# EAGLE design Anemometro8285 (EAGLE 7.5.0)
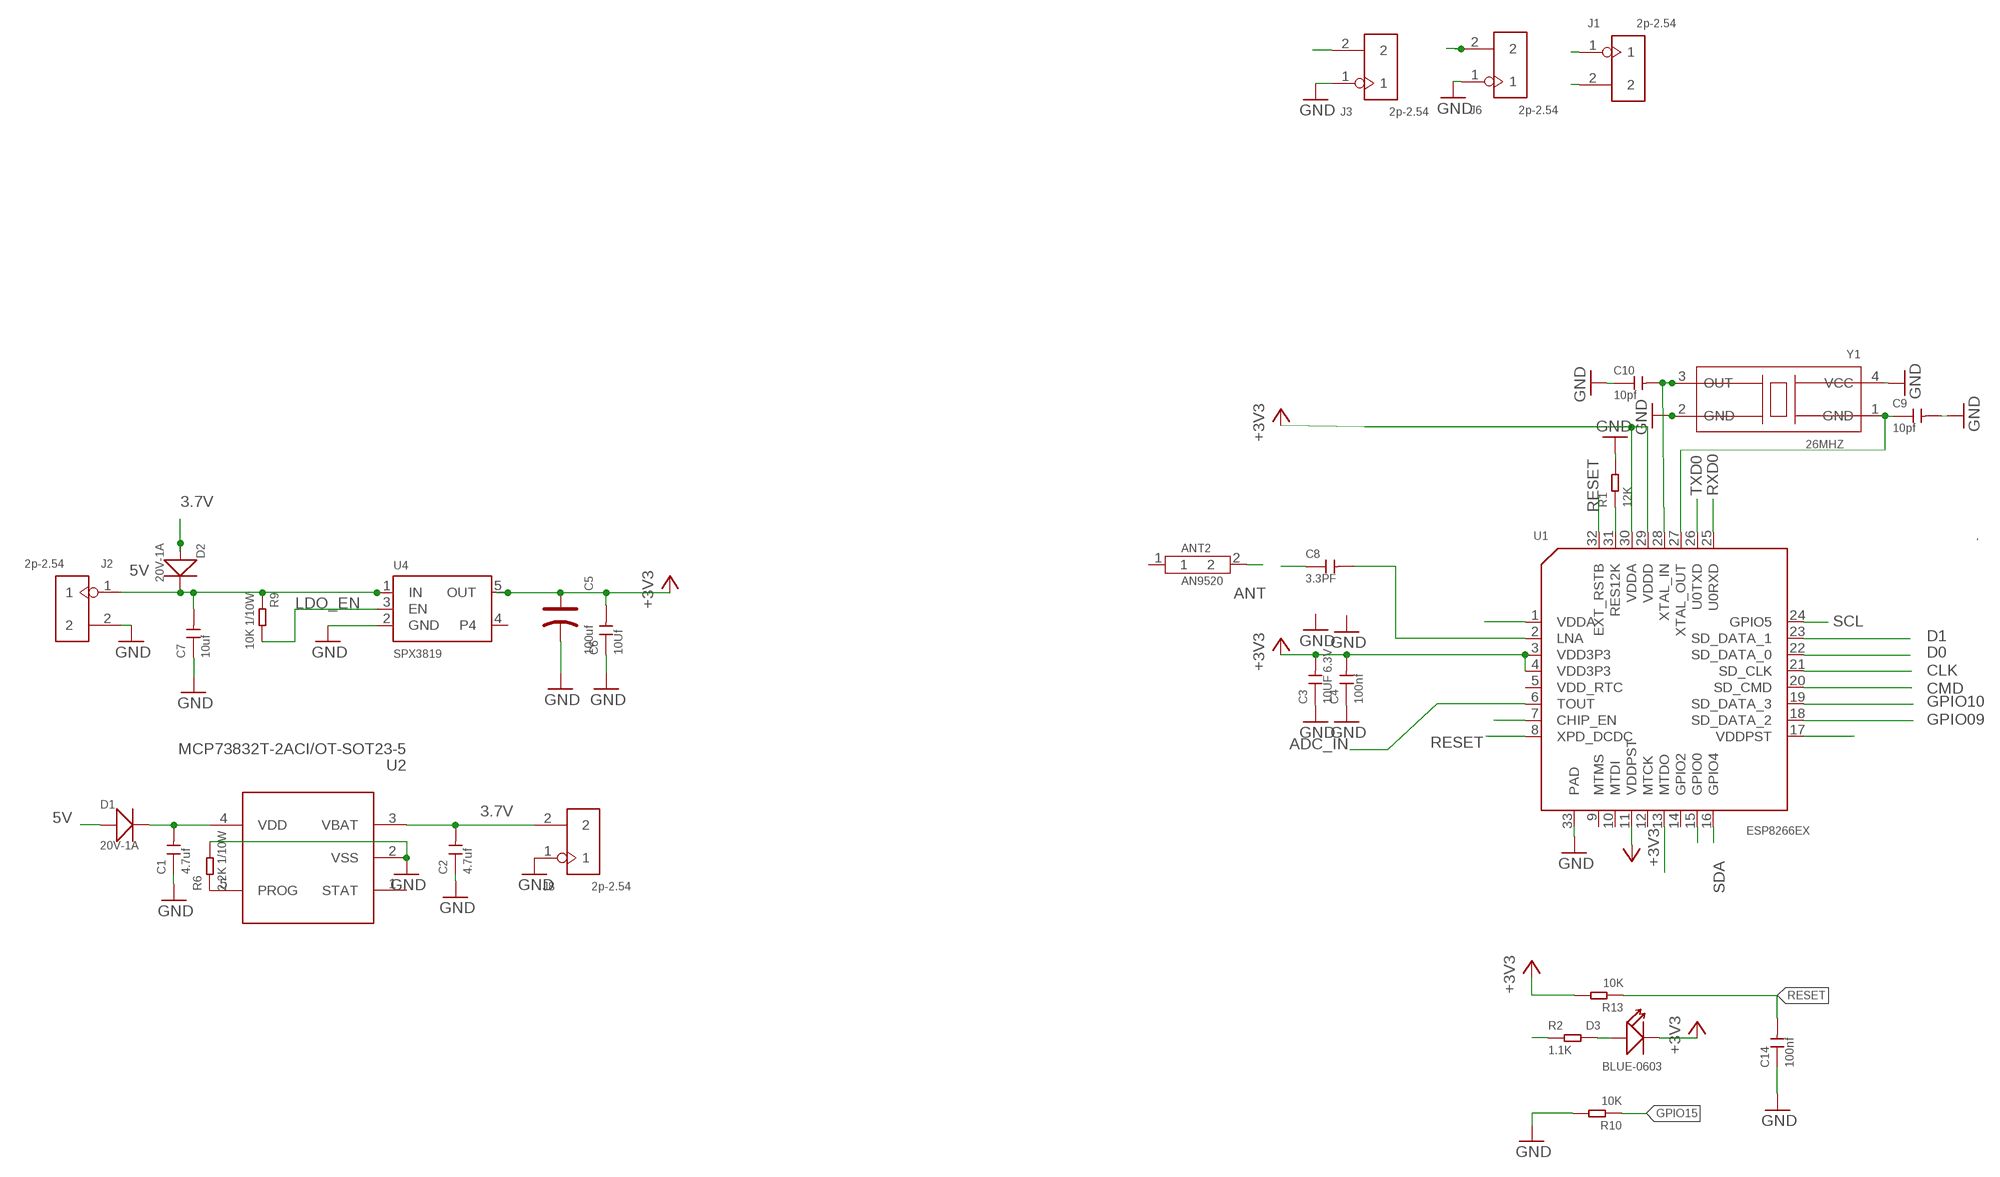
[diagram p0: schematic, sheet 1]

## Parts
ANT2  AN9520  SMD-BUILT-IN-ANTENNA-2.4GHZ(2P-9.5X2.1MM)  [ANT2-SMD-9.5X2X1.2MM]
C1  4.7uf  CERAMIC-4.7UF-10V-10%-X5R(0603)  [C0603]
C2  4.7uf  CERAMIC-4.7UF-10V-10%-X5R(0603)  [C0603]
C3  10UF 6.3V  CERAMIC-10UF-6.3V-20%-X5R(0603)  [C0603]
C4  100nf  CERAMIC-100NF-50V-10%-X7R(0603)  [C0603]
C5  100uf  TANTALUM-SMD-100UF-10V(AVX-B)  [AVX-B]
C6  10Uf  CERAMIC-100NF-50V-10%-X7R(0603)  [C0603]
C7  10uf  CERAMIC-10UF-25V-10%-X5R(0805)  [C0805]
C8  3.3PF  CERAMIC-3.3PF-50V-0.25PF-NPO(0603)  [C0603]
C9  10pf  CERAMIC-10PF-50V-5%-NPO(0603)  [C0603]
C10  10pf  CERAMIC-10PF-50V-5%-NPO(0603)  [C0603]
C14  100nf  CERAMIC-100NF-50V-10%-X7R(0603)  [C0603]
D1  20V-1A  SMD-DIODE-SCHOTTKY-20V-1A(SOD-123)  [SOD-123]
D2  20V-1A  SMD-DIODE-SCHOTTKY-20V-1A(SOD-123)  [SOD-123]
D3  BLUE-0603  SMD-LED-CLEAR-BLUE(0603)  [LED-0603]
J1  2p-2.54  DIP-BLACK-FEMALE-HEADER-VERT(2P-2.54)  [H2-2.54]
J2  2p-2.54  DIP-BLACK-FEMALE-HEADER-VERT(2P-2.54)  [H2-2.54]
J3  2p-2.54  DIP-BLACK-MALE-HEADER-VERT(2P-2.54)  [H2-2.54]
J6  2p-2.54  DIP-BLACK-MALE-HEADER-VERT(2P-2.54)  [H2-2.54]
J8  2p-2.54  DIP-BLACK-FEMALE-HEADER-VERT(2P-2.54)  [H2-2.54]
R1  12K  SMD-RES-12K-1%-1/10W(0603)  [R0603]
R2  1.1K  SMD-RES-1.1K-5%-1/10W(0603)  [R0603]
R6  2.2K 1/10W  SMD-RES-2.2K-1%-1/10W(0603)  [R0603]
R9  10K 1/10W  SMD-RES-10K-5%-1/10W(0603)  [R0603]
R10  10K  SMD-RES-0R-5%-1/10W(0603)  [R0603]
R13  10K  SMD-RES-0R-5%-1/10W(0603)  [R0603]
U1  ESP8266EX  IC-RF-ESP8266EX(QFN32)  [QFN32G-0.5-5X5MM]
U2  MCP73832T-2ACI/OT-SOT23-5  PMIC-MCP73832T-2ACI/OT(SOT23-5)  [SOT-23-5]
U4  SPX3819  VREG_SOT23-5  [SOT23-5]
Y1  26MHZ  SMD-CRYSTAL-26MHZ(4P-2.5X2.0X0.8MM)  [X4-SMD-2.5X2.0X0.5MM]

## Nets
3.7V: C2.2 D2.+ J8.2 U2.3(VBAT)
5V: C7.2 D1.+ D2.- J2.1 R9.1 U4.1(IN)
+3V3: C3.2 C4.2 C5.+ C6.2 D3.- R13.2 U1.1(VDDA) U1.3(VDD3P3) U1.4(VDD3P3) U1.7(CHIP_EN) U1.11(VDDPST) U1.17(VDDPST) U1.29(VDDD) U1.30(VDDA) U4.5(OUT)
ADC_IN: U1.6(TOUT)
ANT: ANT2.2 C8.1
CLK: U1.21(SD_CLK)
CMD: U1.20(SD_CMD)
D0: U1.22(SD_DATA_0)
D1: U1.23(SD_DATA_1)
GND: C1.1 C2.1 C3.1 C4.1 C5.- C6.1 C7.1 C9.2 C10.1 C14.1 J2.2 J3.1 J6.1 J8.1 R1.2 R6.2 R10.2 U1.33(PAD) U2.2(VSS) U4.2(GND) Y1.2(GND) Y1.4(VCC)
GPIO0: J3.2 U1.15(GPIO0)
GPIO09: U1.18(SD_DATA_2)
GPIO10: U1.19(SD_DATA_3)
GPIO15: R10.1 U1.13(MTDO)
LDO_EN: R9.2 U4.3(EN)
N$1: C8.2 U1.2(LNA)
N$2: R6.1 U2.5(PROG)
N$3: C9.1 U1.27(XTAL_OUT) Y1.1(GND)
N$5: R1.1 U1.31(RES12K)
N$6: C10.2 U1.28(XTAL_IN) Y1.3(OUT)
N$7: D3.+ R2.2
N$8: C1.2 D1.- U2.4(VDD)
RESET: C14.2 R13.1 U1.8(XPD_DCDC) U1.32(EXT_RSTB)
RXD0: J1.2 U1.25(U0RXD)
SCL: J6.2 U1.24(GPIO5)
SDA: U1.16(GPIO4)
TXD0: J1.1 R2.1 U1.26(U0TXD)
Unconnected: ANT2.1 U1.5(VDD_RTC) U1.9(MTMS) U1.10(MTDI) U1.12(MTCK) U1.14(GPIO2) U2.1(STAT) U4.4

## Library data of the parts
ANT2 = Seeed-OPL-Antenna:SMD-BUILT-IN-ANTENNA-2.4GHZ(2P-9.5X2.1MM): 318010004; MPN: an9520
C1 C2 = Seeed-OPL-Capacitor:CERAMIC-4.7UF-10V-10%-X5R(0603): 302010111; MPN: CC0603KRX5R6BB475
C3 = Seeed-OPL-Capacitor:CERAMIC-10UF-6.3V-20%-X5R(0603): 302010286; MPN: CC0603MRX5R5BB106
C4 C14 = Seeed-OPL-Capacitor:CERAMIC-100NF-50V-10%-X7R(0603): 302010138; MPN: CC0603KRX7R9BB104
C5 = Seeed-OPL-Capacitor:TANTALUM-SMD-100UF-10V(AVX-B): 302020015; MPN: TAJB107M010#NJ
C6 = Seeed-OPL-Capacitor:CERAMIC-100NF-50V-10%-X7R(0603): 302010138; MPN: CC0603KRX7R9BB104; VALUE: 100nf
C7 = Seeed-OPL-Capacitor:CERAMIC-10UF-25V-10%-X5R(0805): 302010178; MPN: CC0805KKX5R8BB106
C8 = Seeed-OPL-Capacitor:CERAMIC-3.3PF-50V-0.25PF-NPO(0603): 302010081
C9 C10 = Seeed-OPL-Capacitor:CERAMIC-10PF-50V-5%-NPO(0603): 302010097
D1 D2 = Seeed-OPL-Diode:SMD-DIODE-SCHOTTKY-20V-1A(SOD-123): 304020034; MPN: B5819W
D3 = Seeed-OPL-Diode:SMD-LED-CLEAR-BLUE(0603): 304090045; MPN: 19-217-BHC-ZL1M2RY-3T
J1 J2 J8 = Seeed-OPL-Connector:DIP-BLACK-FEMALE-HEADER-VERT(2P-2.54): 320030023; MPN: F185-1102A1BSYA1
J3 J6 = Seeed-OPL-Connector:DIP-BLACK-MALE-HEADER-VERT(2P-2.54): 320020016; MPN: P125-1102A0BS116A1
R1 = Seeed-OPL-Resistor:SMD-RES-12K-1%-1/10W(0603): 301010102; MPN: RC0603FR-0712KL
R2 = Seeed-OPL-Resistor:SMD-RES-1.1K-5%-1/10W(0603): 301010115; MPN: RC0603JR-071K1L
R6 = Seeed-OPL-Resistor:SMD-RES-2.2K-1%-1/10W(0603): 301010200; MPN: RC0603FR-072K2L
R9 = Seeed-OPL-Resistor:SMD-RES-10K-5%-1/10W(0603): 301010293; MPN: RC0603JR-0710KL
R10 R13 = Seeed-OPL-Resistor:SMD-RES-0R-5%-1/10W(0603): 301010292; MPN: RC0603JR-070RL; VALUE: 0R
U1 = Seeed-OPL-ic:IC-RF-ESP8266EX(QFN32): 310060034; MPN: ESP8266EX
U2 = Seeed-OPL-ic:PMIC-MCP73832T-2ACI/OT(SOT23-5): 310030238; MPN: MCP73832T-2ACI/OT
U4 = microbuilder:VREG_SOT23-5: SOT23-5 Fixed Voltage Regulators Part Current Out V Out V In V Dropout θJA (°C/W) TJ (°C) Digikey Part No. ADP121 150mA 3.3V 3.4-5.5V 0.09V @ 150mA -- -- ADP121-AUJZ33R7CT-ND ADP121 150mA 3.0V 3.1-5.5V 0.09V @ 150mA -- -- ADP121-AUJZ30R7CT-ND ADP122 300mA 3.3V 3.4-5.5V 0.085V @ 300mA -- -- ADP122AUJZ-3.3-R7CT-ND ADP1712 300mA 3.3V 3.5-5.5V 0.17V @ 300mA -- -- ADP1712AUJZ-3.3-R7TR-ND AP7311 (Low Cost) 150mA 3.3V 3.5-6V 0.15V @ 150mA -- -- AP7311-33WG-7DICT-ND LD39015M18R 150mA 1.8V 1.9V-5.5V 0.08V @ 100mA -- -- 497-6977-1-ND LP2985A-33DBVR 150mA 3.3V 3.3-16V 0.28V @ 150mA 206 150 296-18479-1-ND MCP1824T-3302E/OT 300mA 3.3V 3.5V-6V 0.2V @ 300mA -- -- MCP1824T-3302E/OTCT-ND MIC5205-2.5YM5 TR 150mA 2.5V 2.7-16V 0.165V @ 150mA -- -- 576-1257-2-ND MIC5205-3.0YM5 TR 150mA 3.0V 3.2V-16V 0.165V @ 150mA -- -- 576-1258-2-ND MIC5205-3.3YM5 TR 150mA 3.3V 3.5V-16V 0.165V @ 150mA -- -- 576-1259-2-ND TPS780330220 150mA 3.3V+2.2V 3.6-5.5V 250mV Max -- -- 296-23332-1-ND TDA3663/N1,135 100mA 3.3V 3.5-45V 0.18V @ 50mA -- -- 568-5343-1-ND Max operating temp can be calculated using θJA, TJ (max junction temperature), and power in watts. Set the "Maximum Ambient Temperature" until it reaches TJ ("Max Junction Temperature"), which is the absolute limit for safe use of the regulator: Heat Sink Temperature Calculator <http://www.daycounter.com/Calculators/Heat-Sink-Temperature-Calculator.phtml> For example, With 12V source into a 3.3V LP2985 and a 30mA load, we are dissipating (12V-3.3V) * 0.03A = 0.261W. With a θJA of 206 °C/W, a TJ of 150°C, and 261mW we can safely use the chip without a heat sink up to 75°C (=147.1°C Junction Temperature).
Y1 = Seeed-OPL-Crystal-Oscillator:SMD-CRYSTAL-26MHZ(4P-2.5X2.0X0.8MM): 306010083; MPN: 7L26002009

## Board
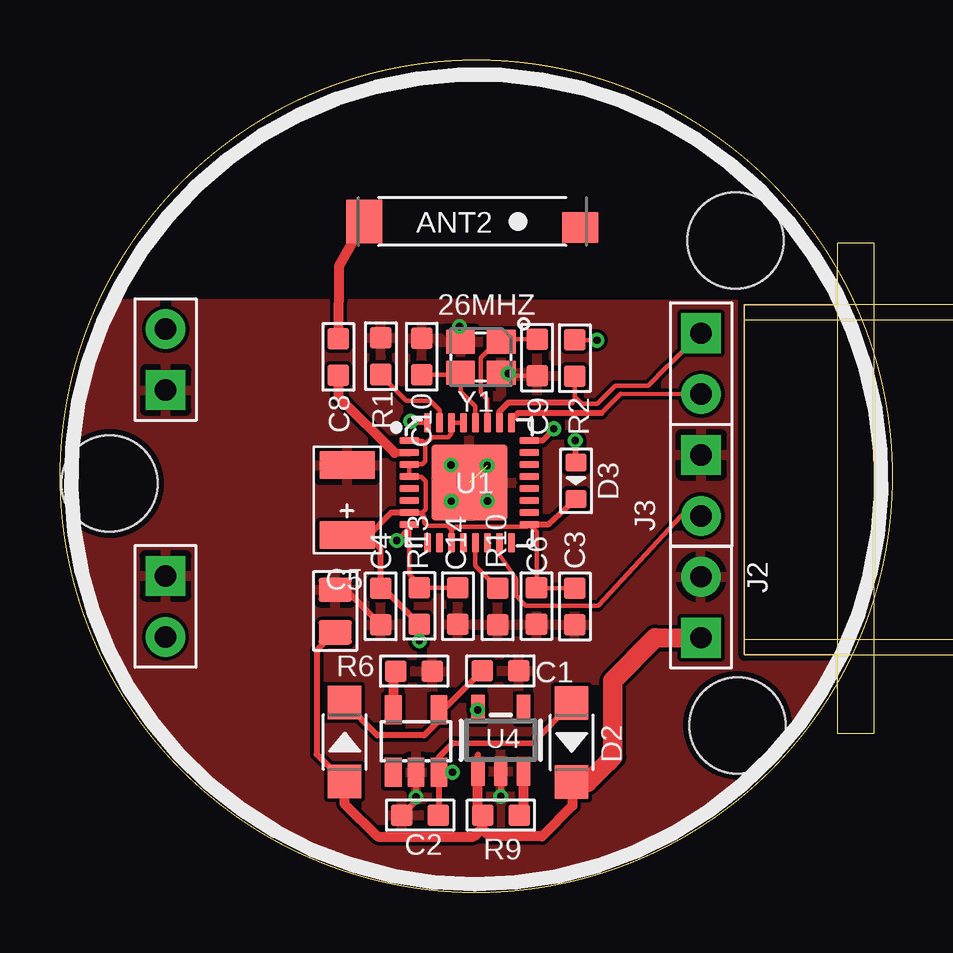
[diagram p1: board, top side]
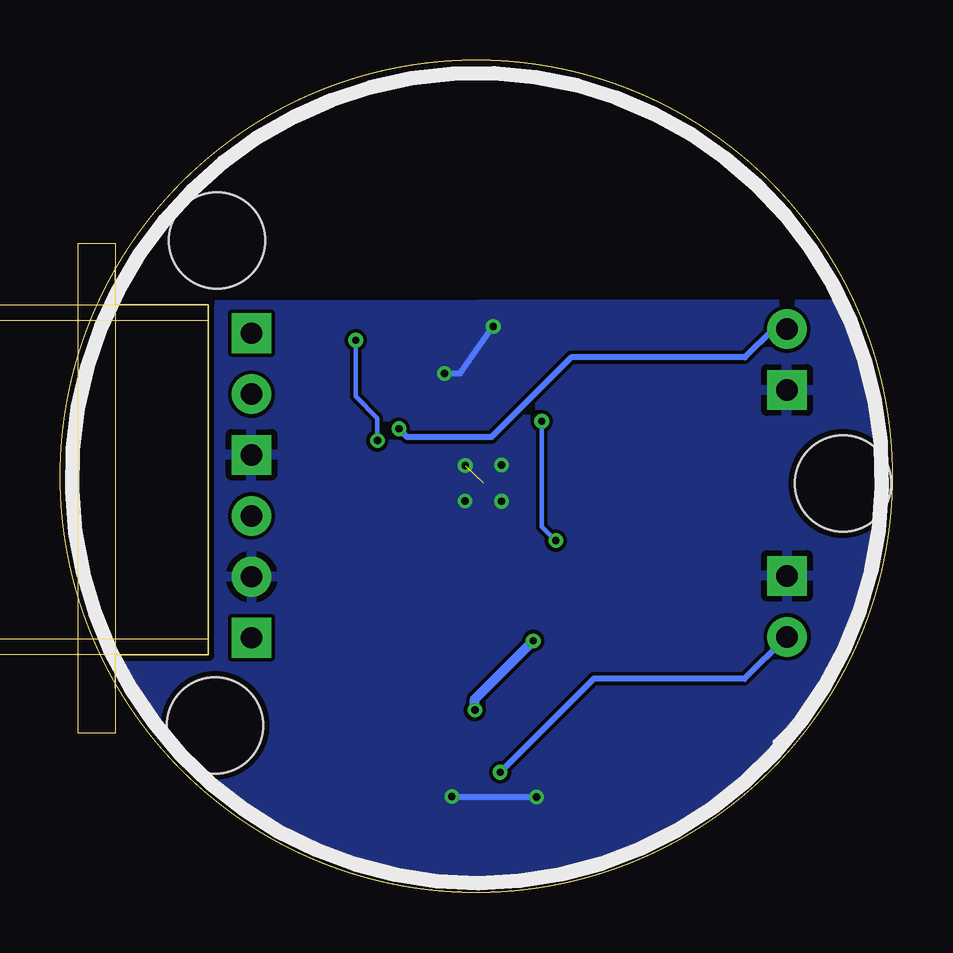
[diagram p2: board, bottom side, seen from below]

Size 34.69 x 34.69 mm. Coordinates in mm from the lower left corner, seen from the top.
Outline: 32.4,8.5 32.4,9.9 28.51,9.9 28.51,24.5 32.4,24.5 32.4,26.05
Outline: circle at 17.35,17.35 radius 17.35
Copper layers (1*16): Top 0.035mm / dielectric 1.5mm / Bottom 0.035mm
Design rules "SeeedStudio_2layer_DRU_no_angle_20140221": minimum track width 6mil, minimum drill 12mil, track to track 6mil, track to pad 6mil, pad to pad 6mil, via to via 6mil, smd to smd 0mil, copper to edge 10mil, drill to drill 10mil, minimum pad ring 10mil, minimum via ring 6mil, stop-mask expansion 2mil, vias tented up to drill 100mil, thermal gap 10mil
Holes 4 mm at 28.14,27.17 2.07,17.05 28.23,6.97
Milling: area 32.4,6.6 to 33.9,27.1; area 28.5,10.6 to 37.5,24.5; area 28.5,9.9 to 37.5,23.8

### Footprints (pad centres in the part's own frame; a part is rotated, then mirrored left to right if it is on the bottom)
ANT2-SMD-9.5X2X1.2MM = smd 1.5 x 1.27: 1 -4.5,0.254 | smd 1.5 x 1.8: 2 4.5,0
C0603 = smd 0.889 x 0.889: 1 0,0.762; 2 0,-0.762
AVX-B = smd 1.143 x 2.286: + -1.46,0; - 1.46,0
C0805 = smd 1.397 x 1.016: 1 0,0.889; 2 0,-0.889
SOD-123 = smd 1.397 x 1.397: + -1.651,0; - 1.651,0
LED-0603 = smd 0.762 x 0.889: + -0.762,0; - 0.762,0
H2-2.54 = drill 0.889 pad 1.651 square: 1 0,1.27 | drill 0.889 pad 1.651: 2 0,-1.27
R0603 = smd 0.889 x 0.889: 1 0,0.762; 2 0,-0.762
QFN32G-0.5-5X5MM = smd 0.813 x 0.279: 1 -2.5,1.75; 2 -2.5,1.25; 3 -2.5,0.75; 4 -2.5,0.25; 5 -2.5,-0.25; 6 -2.5,-0.75; 7 -2.5,-1.25; 8 -2.5,-1.75; 17 2.5,-1.75; 18 2.5,-1.25; 19 2.5,-0.75; 20 2.5,-0.25; 21 2.5,0.25; 22 2.5,0.75; 23 2.5,1.25; 24 2.5,1.75 | smd 0.279 x 0.813: 9 -1.75,-2.5; 10 -1.25,-2.5; 11 -0.75,-2.5; 12 -0.25,-2.5; 13 0.25,-2.5; 14 0.75,-2.5; 15 1.25,-2.5; 16 1.75,-2.5; 25 1.75,2.5; 26 1.25,2.5; 27 0.75,2.5; 28 0.25,2.5; 29 -0.25,2.5; 30 -0.75,2.5; 31 -1.25,2.5; 32 -1.75,2.5 | smd 3.175 x 3.175: 33 0,0
SOT-23-5 = smd 0.69 x 1.2: 1 -0.95,-1.3; 2 0,-1.3; 3 0.95,-1.3; 4 0.95,1.3; 5 -0.95,1.3
SOT23-5 = smd 0.55 x 1.2: 1 -0.95,-1.3; 2 0,-1.3; 3 0.95,-1.3; 4 0.95,1.3; 5 -0.95,1.3
X4-SMD-2.5X2.0X0.5MM = smd 1.2 x 1: 1 -0.85,-0.65; 2 0.85,-0.65; 3 0.85,0.65; 4 -0.85,0.65

### Placement (x,y rotation side)
ANT2  17.18,27.96 180 top
C1  18.35,9.24 270 top
C2  15,3.22 90 top
C3  21.45,11.92 180 top
C4  13.36,11.93 180 top
C5  11.96,16.35 90 top
C6  19.85,11.94 180 top
C7  11.47,11.73 0 top
C8  11.6,22.32 0 top
C9  19.88,22.29 0 top
C10  15.07,22.33 0 top
C14  16.58,11.93 180 top
D1  11.86,6.27 90 top
D2  21.32,6.25 270 top
D3  21.5,17.16 270 top
J1  26.71,22.04 0 top
J2  26.71,11.89 180 top
J3  26.71,16.97 0 top
J6  4.4,22.21 180 top
J8  4.4,11.92 0 top
R1  13.37,22.35 180 top
R2  21.45,22.27 180 top
R6  14.75,9.22 90 top
R9  18.37,3.23 90 top
R10  18.24,11.92 0 top
R13  14.98,11.94 0 top
U1  17.06,17.08 0 top
U2  14.84,6.31 0 top
U4  18.37,6.35 0 top
Y1  17.54,22.31 180 top

### Tracks (layer width: path | path; a pad name or v marks a point on that pad's centre or on a via)
3.7V  (via drill 0.3)
  Top 0.254: U2.3 15.79,3.24 C2.2 | U2.3 15.79,5.64 16.38,6.24 19.69,6.22 D2.+ | v16.35,5.02 U2.3
  Bottom 0.254: J8.2 4.45,10.61 6.17,8.9 12.45,8.92 v16.35,5.02
5V
  Top 0.254: C7.2 11.22,10.61 10.7,10.1 10.7,5.76 D1.+ | U4.1 17.42,5.76
  Top 0.406: U4.1 17.42,3.38 R9.1 17.61,2.72 | D2.- 21.34,3.61 20.09,2.35 17.92,2.35 17.61,2.61 17.61,2.72 | D1.+ 11.85,3.7 13.25,2.33 17.24,2.33 17.61,2.72
  Top 0.813: 26.7,10.27 J2.1 26.87,10.46 27.05,10.55 26.83,10.6 24.8,10.61 23.04,8.82 23.04,5.66 22.79,5.41 | D2.- 21.98,4.6 22.79,5.41 | 22.79,5.41
+3V3  (via drill 0.3)
  Top 0.178: U1.7 | U1.7 15.1,15.83 15.24,15.97 15.24,17.14 15.05,17.33 U1.4 U1.3 14.57,17.84 15.1,17.84 15.23,17.97 15.23,18.7 | U1.7 15,15.83 15.17,15.65 15.17,15.41 15.3,15.28 16.15,15.28 16.31,15.11 U1.11 16.31,15.07 16.48,15.24 19.47,15.24 U1.17 | 19.58,15.35 U1.17 | U1.1 15.1,18.83 15.23,18.7 | U1.29 U1.30 16.31,19.11 16.18,18.98 15.51,18.98 15.23,18.7 | C3.2 19.87,12.68 C6.2 19.85,15.04 U1.17
  Top 0.254: 19.58,15.35 20.37,15.35 D3.- | R13.2 13.47,12.69 C4.2 13.35,14.34 12.83,14.86 | 12.83,14.86 12.68,15.01 12.09,15.01 C5.+ | U1.7 13.81,15.83 12.83,14.86
  Top 0.406: U4.5 17.42,7.62 v17.4,7.6 | v14.97,10.49 R13.2
  Bottom 0.406: v17.4,7.6 17.4,8.06 v14.97,10.49
ANT
  Top 0.406: ANT2.2 11.62,26.11 C8.1
GND  (via drill 0.3)  (1 unrouted)
  Top 0.178: C9.2 18.52,21.53 Y1.4
  Top 0.254: C2.1 14.84,3.82 v14.84,3.98 U2.2 | U4.2 v18.37,4 v18.36,4 | C7.1 11.9,12.62 C4.1 | Y1.4 18.46,21.66 v18.67,21.63 | v16.64,23.59 16.62,23.71 16.72,23.72 16.72,23.68 v16.64,23.59
  Bottom 0.254: v18.36,4 14.85,4 v14.84,3.98 | v18.67,21.63 18.02,21.63 v16.64,23.59
  other vias: 17.8,17.79 16.29,17.81 16.3,16.31 17.81,16.31
  pour Top: 1.92,24.53 arc119 19.23,0.46 arc108 32.81,24.5
  pour Bottom: 1.91,24.53 arc117 19.12,0.41 arc108 32.7,24.5
GPIO0
  Top 0.178: J3.2 25.89,15.7 22.43,11.96 19.41,11.96 19.01,12.36 19.01,13.08 18.31,14.06 U1.15
GPIO15
  Top 0.178: U1.13 17.31,13.61 R10.1
LDO_EN
  Top 0.406: R9.2 19.32,3.38 U4.3
N$1
  Top 0.305: U1.2 13.95,18.32
  Top 0.406: C8.2 11.6,20.66 13.95,18.32
N$2
  Top 0.406: R6.1 13.89,9.15 U2.5
N$3
  Top 0.178: C9.1 18.48,23.05 Y1.1 18.2,22.96 17.52,22.28 17.52,20.84 17.81,20.55 U1.27
N$5
  Top 0.178: R1.1 13.76,21.16 14.44,20.48 15.42,20.48 15.82,20.09 U1.31
N$6
  Top 0.178: C10.2 16.61,21.58 Y1.3 16.69,20.88 17.31,20.26 U1.28
N$7  (via drill 0.3)
  Top 0.178: v22.37,23.01 21.47,23.01 R2.2
  Top 0.254: D3.+ v21.47,18.83
  Bottom 0.178: v21.47,18.83 21.47,19.76 22.37,20.67 22.37,22.29 v22.37,23.01
N$8
  Top 0.254: C1.2 15.96,7.61 U2.4 15.79,7.17 15.17,6.56 13.22,6.56 D1.-
RESET  (via drill 0.3)
  Top 0.178: C14.2 15.06,12.7 R13.1 15.05,12.74 14.54,13.25 14.54,15.31 U1.8 14.56,15.19 v14.03,14.67 | v14.62,19.64 14.67,19.58 U1.32
  Bottom 0.178: v14.03,14.67 14.62,15.25 v14.62,19.64
RXD0
  Top 0.178: J1.2 23.36,20.78 22.57,19.99
  Top 0.254: U1.25 18.81,19.7 19.09,19.99 22.57,19.99
SCL  (via drill 0.3)
  Top 0.254: v20.57,19.33 20.57,19.3 20.11,18.83 U1.24
  Bottom 0.254: J6.2 4.98,23.48 6.16,22.3 13.4,22.3 16.72,18.98 20.23,18.98 v20.57,19.33
TXD0
  Top 0.178: R2.1 21.45,20.65 | 21.45,20.65 21.45,20.55 21.33,20.43 | J1.1 24.88,21.51 24.88,21.5 24.5,21.12 23.13,21.12 22.38,20.37 21.73,20.37 21.45,20.65
  Top 0.254: U1.26 18.31,20.04 18.7,20.43 21.33,20.43

### Text on the board
bNames: C:/Users/Jorge Trincado/Google Drive/logoInvertido.bmp